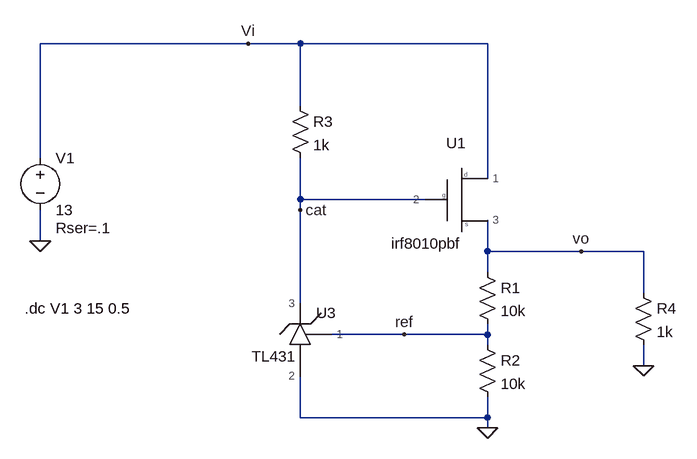
[diagram p0: schematic Regulador5V.asc]
Regulador5V.asc, the LTspice schematic file:
Version 4
SHEET 1 1164 680
WIRE 160 -64 -160 -64
WIRE 240 -64 160 -64
WIRE 528 -64 240 -64
WIRE 240 32 240 -64
WIRE -160 112 -160 -64
WIRE 528 144 528 -64
WIRE 240 176 240 112
WIRE 432 176 240 176
WIRE 240 192 240 176
WIRE -160 240 -160 192
WIRE 528 256 528 208
WIRE 672 256 528 256
WIRE 768 256 672 256
WIRE 528 288 528 256
WIRE 768 320 768 256
WIRE 240 336 240 192
WIRE 400 384 288 384
WIRE 528 384 528 368
WIRE 528 384 400 384
WIRE 528 400 528 384
WIRE 768 432 768 400
WIRE 240 512 240 448
WIRE 528 512 528 480
WIRE 528 512 240 512
WIRE 528 528 528 512
FLAG -160 240 0
FLAG 528 528 0
FLAG 400 384 ref
FLAG 160 -64 Vi
FLAG 768 432 0
FLAG 240 192 cat
FLAG 672 256 vo
SYMBOL voltage -160 96 R0
WINDOW 123 0 0 Left 0
WINDOW 39 24 124 Left 2
SYMATTR SpiceLine Rser=.1
SYMATTR InstName V1
SYMATTR Value 13
SYMBOL res 512 272 R0
SYMATTR InstName R1
SYMATTR Value 10k
SYMBOL res 512 384 R0
SYMATTR InstName R2
SYMATTR Value 10k
SYMBOL res 224 16 R0
SYMATTR InstName R3
SYMATTR Value 1k
SYMBOL res 752 304 R0
SYMATTR InstName R4
SYMATTR Value 1k
SYMBOL AutoGenerated\\TL431 240 384 R0
WINDOW 0 40 -18 Bottom 2
SYMATTR InstName U3
SYMBOL irf8010pbf 480 176 R0
WINDOW 3 -46 52 Top 2
SYMATTR InstName U1
TEXT -184 344 Left 2 !.dc V1 3 15 0.5

The netlist it stands for:
* Regulador5V.asc
V1 Vi 0 13 Rser=.1
R1 vo ref 10k
R2 ref 0 10k
R3 Vi cat 1k
R4 vo 0 1k
XU3 ref 0 cat TL431  ; pins 1 2 3
XU1 Vi cat vo irf8010pbf  ; pins 1 2 3
.dc V1 3 15 0.5
.lib C:\Users\R Esteban A\Desktop\Circuits_Electronics\Regulador5V\tl431.txt
.lib C:\Users\R Esteban A\Desktop\Circuits_Electronics\Regulador5V\irf8010pbf.spi
.backanno
.end